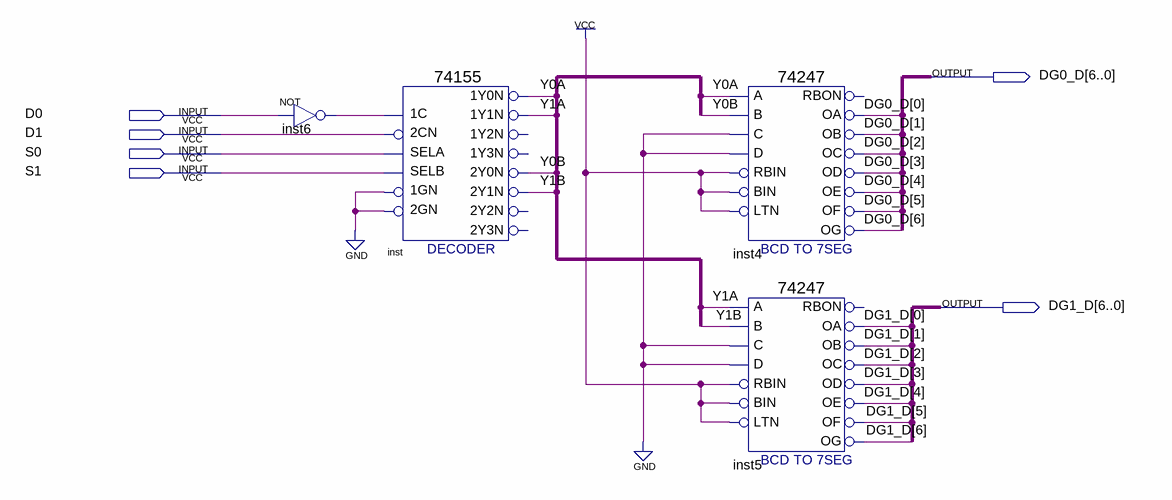
[diagram p0: schematic sheet]
// Quartus schematic L0502.bdf as structural Verilog: 4 symbols, 6 pins
module L0502 (
  input  D0,
  input  D1,
  input  S0,
  input  S1,
  output [6:0] DG0_D,
  output [6:0] DG1_D
);

  wire inst6_out, Y0A, Y0B, Y1A, Y1B;

  not inst6 (inst6_out, D0);
  \74155  inst (
    .\1C (inst6_out), .\2CN (D1), .SELB(S1), .SELA(S0), .\1GN (1'b0), .\2GN (1'b0), .\1Y1N (Y1A),
    .\1Y0N (Y0A), .\2Y1N (Y1B), .\2Y0N (Y0B));  // open: 1Y2N, 1Y3N, 2Y3N, 2Y2N
  \74247  inst4 (
    .LTN(1'b1), .BIN(1'b1), .A(Y0A), .B(Y0B), .RBIN(1'b1), .C(1'b0), .D(1'b0), .OF(DG0_D[5]), .OC(DG0_D[2]),
    .OD(DG0_D[3]), .OE(DG0_D[4]), .OA(DG0_D[0]), .OB(DG0_D[1]), .OG(DG0_D[6]));  // open: RBON
  \74247  inst5 (
    .LTN(1'b1), .BIN(1'b1), .A(Y1A), .B(Y1B), .RBIN(1'b1), .C(1'b0), .D(1'b0), .OF(DG1_D[5]), .OC(DG1_D[2]),
    .OD(DG1_D[3]), .OE(DG1_D[4]), .OA(DG1_D[0]), .OB(DG1_D[1]), .OG(DG1_D[6]));  // open: RBON
endmodule
